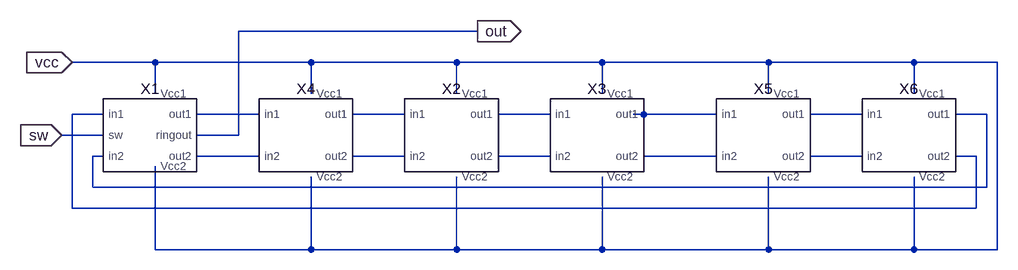
[diagram p0: schematic ring24.asc]
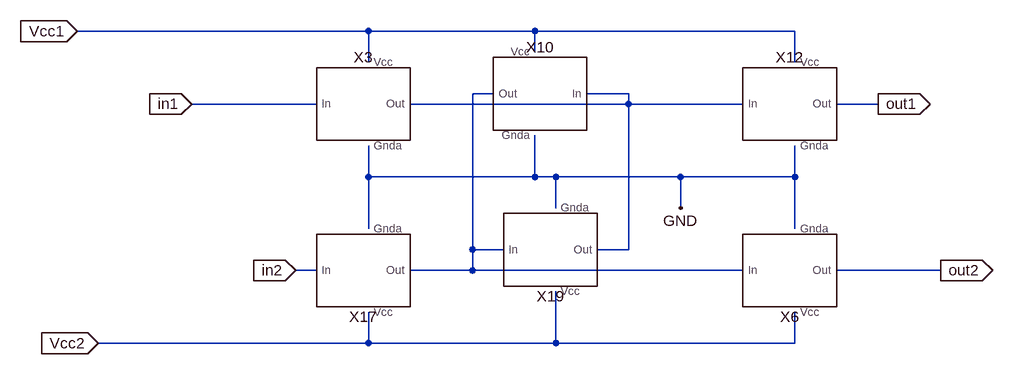
[diagram p1: sub-circuit unit.asc]
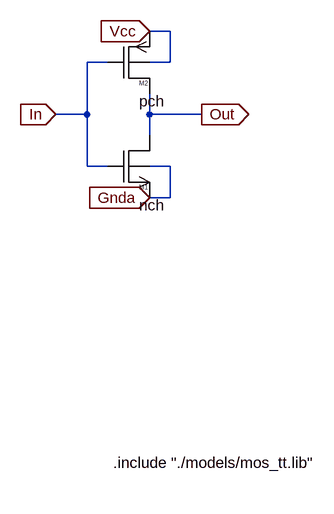
[diagram p2: sub-circuit inverter.asc]
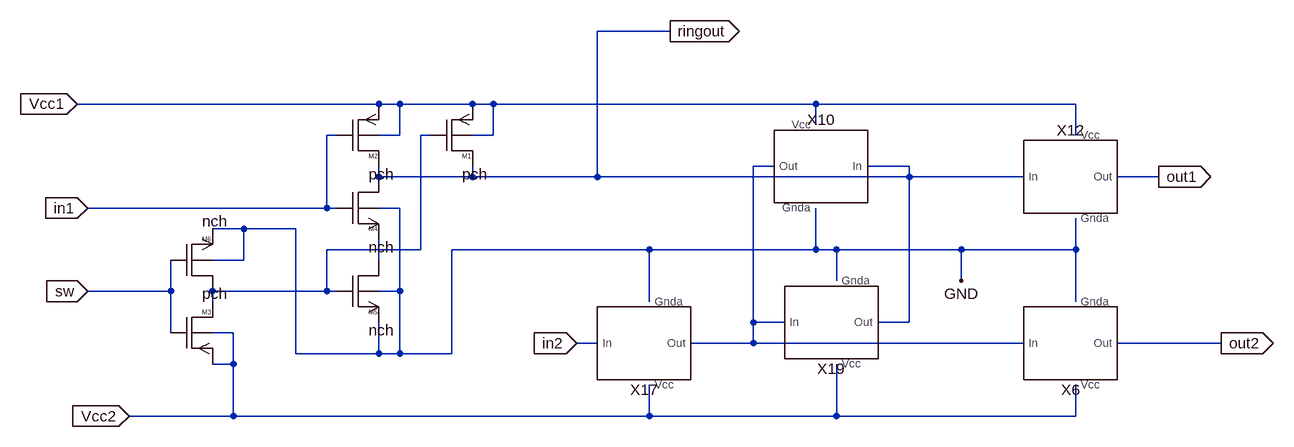
[diagram p3: sub-circuit unit_nand.asc]
ring24.asc, the LTspice schematic file:
Version 4
SHEET 1 948 680
WIRE 128 -32 -240 -32
WIRE -368 16 -496 16
WIRE -128 16 -368 16
WIRE 96 16 -128 16
WIRE 320 16 96 16
WIRE 576 16 320 16
WIRE 800 16 576 16
WIRE 928 16 800 16
WIRE -368 64 -368 16
WIRE -128 64 -128 16
WIRE 96 64 96 16
WIRE 320 64 320 16
WIRE 576 64 576 16
WIRE 800 64 800 16
WIRE -448 96 -496 96
WIRE -208 96 -304 96
WIRE 16 96 -64 96
WIRE 240 96 160 96
WIRE 384 96 368 96
WIRE 496 96 384 96
WIRE 720 96 640 96
WIRE 912 96 864 96
WIRE -448 128 -512 128
WIRE -240 128 -240 -32
WIRE -240 128 -304 128
WIRE -448 160 -464 160
WIRE -208 160 -304 160
WIRE 16 160 -64 160
WIRE 240 160 160 160
WIRE 496 160 384 160
WIRE 720 160 640 160
WIRE 896 160 864 160
WIRE -464 208 -464 160
WIRE 912 208 912 96
WIRE 912 208 -464 208
WIRE -496 240 -496 96
WIRE 896 240 896 160
WIRE 896 240 -496 240
WIRE -368 304 -368 176
WIRE -128 304 -128 192
WIRE -128 304 -368 304
WIRE 96 304 96 192
WIRE 96 304 -128 304
WIRE 320 304 320 192
WIRE 320 304 96 304
WIRE 576 304 576 192
WIRE 576 304 320 304
WIRE 800 304 800 192
WIRE 800 304 576 304
WIRE 928 304 928 16
WIRE 928 304 800 304
FLAG 128 -32 out
IOPIN 128 -32 Out
FLAG -496 16 vcc
IOPIN -496 16 In
FLAG -512 128 sw
IOPIN -512 128 In
SYMBOL UNIT -144 128 R0
SYMATTR InstName X4
SYMBOL UNIT_nand -384 128 R0
SYMATTR InstName X1
SYMBOL UNIT 80 128 R0
SYMATTR InstName X2
SYMBOL UNIT 304 128 R0
SYMATTR InstName X3
SYMBOL UNIT 560 128 R0
SYMATTR InstName X5
SYMBOL UNIT 784 128 R0
SYMATTR InstName X6

unit.asc, the sub-circuit schematic file:
Version 4
SHEET 1 2512 992
WIRE -1520 -880 -1968 -880
WIRE -1264 -880 -1520 -880
WIRE -864 -880 -1264 -880
WIRE -1264 -848 -1264 -880
WIRE -1520 -832 -1520 -880
WIRE -864 -832 -864 -880
WIRE -1328 -784 -1360 -784
WIRE -1120 -784 -1184 -784
WIRE -1600 -768 -1792 -768
WIRE -1120 -768 -1120 -784
WIRE -1120 -768 -1456 -768
WIRE -944 -768 -1120 -768
WIRE -736 -768 -800 -768
WIRE -1520 -656 -1520 -704
WIRE -1264 -656 -1264 -720
WIRE -1264 -656 -1520 -656
WIRE -1232 -656 -1264 -656
WIRE -1040 -656 -1232 -656
WIRE -864 -656 -864 -704
WIRE -864 -656 -1040 -656
WIRE -1232 -608 -1232 -656
WIRE -1040 -608 -1040 -656
WIRE -1520 -576 -1520 -656
WIRE -864 -576 -864 -656
WIRE -1360 -544 -1360 -784
WIRE -1312 -544 -1360 -544
WIRE -1120 -544 -1120 -768
WIRE -1120 -544 -1168 -544
WIRE -1600 -512 -1632 -512
WIRE -1360 -512 -1360 -544
WIRE -1360 -512 -1456 -512
WIRE -944 -512 -1360 -512
WIRE -640 -512 -800 -512
WIRE -1520 -400 -1520 -448
WIRE -1520 -400 -1936 -400
WIRE -1232 -400 -1232 -480
WIRE -1232 -400 -1520 -400
WIRE -864 -400 -864 -448
WIRE -864 -400 -1232 -400
FLAG -1968 -880 Vcc1
IOPIN -1968 -880 In
FLAG -1792 -768 in1
IOPIN -1792 -768 In
FLAG -736 -768 out1
IOPIN -736 -768 Out
FLAG -1632 -512 in2
IOPIN -1632 -512 In
FLAG -640 -512 out2
IOPIN -640 -512 Out
FLAG -1040 -608 GND
FLAG -1936 -400 Vcc2
IOPIN -1936 -400 In
SYMBOL inverter -1536 -768 R0
SYMATTR InstName X3
SYMBOL inverter -880 -512 M180
SYMATTR InstName X6
SYMBOL inverter -880 -768 R0
SYMATTR InstName X12
SYMBOL inverter -1536 -512 M180
SYMATTR InstName X17
SYMBOL inverter -1248 -784 M0
SYMATTR InstName X10
SYMBOL inverter -1248 -544 M180
SYMATTR InstName X19

inverter.asc, the sub-circuit schematic file:
Version 4
SHEET 1 880 696
WIRE 192 16 160 16
WIRE 96 64 64 64
WIRE 192 64 192 16
WIRE 192 64 160 64
WIRE 64 144 64 64
WIRE 64 144 16 144
WIRE 160 144 160 112
WIRE 240 144 160 144
WIRE 160 176 160 144
WIRE 64 224 64 144
WIRE 96 224 64 224
WIRE 192 224 160 224
WIRE 192 272 192 224
WIRE 192 272 160 272
FLAG 16 144 In
IOPIN 16 144 In
FLAG 240 144 Out
IOPIN 240 144 Out
FLAG 160 16 Vcc
IOPIN 160 16 In
FLAG 160 272 Gnda
IOPIN 160 272 In
SYMBOL nmos4 96 224 R0
WINDOW 3 48 60 Left 2
SYMATTR InstName M1
SYMATTR Value nch
SYMATTR Value2 l=2u w=6u
SYMBOL pmos4 96 64 R0
WINDOW 3 48 60 Left 2
SYMATTR InstName M2
SYMATTR Value pch
SYMATTR Value2 l=2u w=18u
TEXT 104 680 Left 2 !.include "./models/mos_tt.lib"\n

unit_nand.asc, the sub-circuit schematic file:
Version 4
SHEET 1 2512 992
WIRE -1488 -992 -1600 -992
WIRE -1936 -880 -2400 -880
WIRE -1904 -880 -1936 -880
WIRE -1792 -880 -1904 -880
WIRE -1760 -880 -1792 -880
WIRE -1264 -880 -1760 -880
WIRE -864 -880 -1264 -880
WIRE -1264 -848 -1264 -880
WIRE -2000 -832 -2016 -832
WIRE -1904 -832 -1904 -880
WIRE -1904 -832 -1936 -832
WIRE -1856 -832 -1872 -832
WIRE -1760 -832 -1760 -880
WIRE -1760 -832 -1792 -832
WIRE -864 -832 -864 -880
WIRE -1328 -784 -1360 -784
WIRE -1120 -784 -1184 -784
WIRE -1936 -768 -1936 -784
WIRE -1792 -768 -1792 -784
WIRE -1792 -768 -1936 -768
WIRE -1600 -768 -1600 -992
WIRE -1600 -768 -1792 -768
WIRE -1120 -768 -1120 -784
WIRE -1120 -768 -1600 -768
WIRE -944 -768 -1120 -768
WIRE -736 -768 -800 -768
WIRE -2016 -720 -2016 -832
WIRE -2016 -720 -2384 -720
WIRE -2000 -720 -2016 -720
WIRE -1904 -720 -1936 -720
WIRE -2144 -688 -2192 -688
WIRE -2064 -688 -2144 -688
WIRE -1872 -656 -1872 -832
WIRE -1872 -656 -2016 -656
WIRE -1520 -656 -1824 -656
WIRE -1264 -656 -1264 -720
WIRE -1264 -656 -1520 -656
WIRE -1232 -656 -1264 -656
WIRE -1040 -656 -1232 -656
WIRE -864 -656 -864 -704
WIRE -864 -656 -1040 -656
WIRE -2144 -640 -2144 -688
WIRE -2144 -640 -2192 -640
WIRE -1936 -640 -1936 -672
WIRE -1232 -608 -1232 -656
WIRE -1040 -608 -1040 -656
WIRE -2256 -592 -2256 -640
WIRE -2256 -592 -2384 -592
WIRE -2016 -592 -2016 -656
WIRE -2016 -592 -2192 -592
WIRE -2000 -592 -2016 -592
WIRE -1904 -592 -1904 -720
WIRE -1904 -592 -1936 -592
WIRE -2192 -576 -2192 -592
WIRE -1520 -576 -1520 -656
WIRE -864 -576 -864 -656
WIRE -1360 -544 -1360 -784
WIRE -1312 -544 -1360 -544
WIRE -1120 -544 -1120 -768
WIRE -1120 -544 -1168 -544
WIRE -2256 -528 -2256 -592
WIRE -2160 -528 -2192 -528
WIRE -1600 -512 -1632 -512
WIRE -1360 -512 -1360 -544
WIRE -1360 -512 -1456 -512
WIRE -944 -512 -1360 -512
WIRE -640 -512 -800 -512
WIRE -2064 -496 -2064 -688
WIRE -1936 -496 -1936 -544
WIRE -1936 -496 -2064 -496
WIRE -1904 -496 -1904 -592
WIRE -1904 -496 -1936 -496
WIRE -1824 -496 -1824 -656
WIRE -1824 -496 -1904 -496
WIRE -2160 -480 -2160 -528
WIRE -2160 -480 -2192 -480
WIRE -2160 -400 -2160 -480
WIRE -2160 -400 -2320 -400
WIRE -1520 -400 -1520 -448
WIRE -1520 -400 -2160 -400
WIRE -1232 -400 -1232 -480
WIRE -1232 -400 -1520 -400
WIRE -864 -400 -864 -448
WIRE -864 -400 -1232 -400
FLAG -2400 -880 Vcc1
IOPIN -2400 -880 In
FLAG -2384 -720 in1
IOPIN -2384 -720 In
FLAG -736 -768 out1
IOPIN -736 -768 Out
FLAG -1632 -512 in2
IOPIN -1632 -512 In
FLAG -640 -512 out2
IOPIN -640 -512 Out
FLAG -1040 -608 GND
FLAG -2384 -592 sw
IOPIN -2384 -592 In
FLAG -1488 -992 ringout
IOPIN -1488 -992 Out
FLAG -2320 -400 Vcc2
IOPIN -2320 -400 In
SYMBOL inverter -880 -512 M180
SYMATTR InstName X6
SYMBOL inverter -880 -768 R0
SYMATTR InstName X12
SYMBOL inverter -1536 -512 M180
SYMATTR InstName X17
SYMBOL inverter -1248 -784 M0
SYMATTR InstName X10
SYMBOL inverter -1248 -544 M180
SYMATTR InstName X19
SYMBOL pmos4 -1856 -832 R0
WINDOW 3 48 60 Left 2
SYMATTR InstName M1
SYMATTR Value pch
SYMATTR Value2 l=2u w=18u
SYMBOL pmos4 -2000 -832 R0
WINDOW 3 48 60 Left 2
SYMATTR InstName M2
SYMATTR Value pch
SYMATTR Value2 l=2u w=18u
SYMBOL nmos4 -2000 -720 R0
WINDOW 3 48 60 Left 2
SYMATTR InstName M4
SYMATTR Value nch
SYMATTR Value2 l=2u w=6u
SYMBOL nmos4 -2000 -592 R0
WINDOW 3 48 60 Left 2
SYMATTR InstName M5
SYMATTR Value nch
SYMATTR Value2 l=2u w=6u
SYMBOL pmos4 -2256 -528 M180
WINDOW 3 48 60 Left 2
SYMATTR InstName M3
SYMATTR Value pch
SYMATTR Value2 l=2u w=18u
SYMBOL nmos4 -2256 -640 M180
WINDOW 3 48 60 Left 2
SYMATTR InstName M6
SYMATTR Value nch
SYMATTR Value2 l=2u w=6u

The netlist it stands for:
* ring24.asc
XX4 N002 N008 vcc N003 N009 vcc unit
XX1 N001 N007 vcc N002 N008 sw out vcc unit_nand
XX2 N003 N009 vcc N004 N010 vcc unit
XX3 N004 N010 vcc N005 N011 vcc unit
XX5 N005 N011 vcc N006 N012 vcc unit
XX6 N006 N012 vcc N007 N001 vcc unit

* block symbol definitions
.subckt unit in1 in2 Vcc1 out1 out2 Vcc2
XX3 GND in1 Vcc1 N002 inverter
XX6 GND N001 Vcc2 out2 inverter
XX12 GND N002 Vcc1 out1 inverter
XX17 GND in2 Vcc2 N001 inverter
XX10 GND N002 Vcc1 N001 inverter
XX19 GND N001 Vcc2 N002 inverter
.ends unit

.subckt inverter Gnda In Vcc Out
M1 Out In Gnda Gnda nch l=2u w=6u
M2 Out In Vcc Vcc pch l=2u w=18u
.include "./models/mos_tt.lib"
.ends inverter

.subckt unit_nand in1 in2 Vcc1 out1 out2 sw ringout Vcc2
XX6 GND N002 Vcc2 out2 inverter
XX12 GND ringout Vcc1 out1 inverter
XX17 GND in2 Vcc2 N002 inverter
XX10 GND ringout Vcc1 N002 inverter
XX19 GND N002 Vcc2 ringout inverter
M1 ringout N001 Vcc1 Vcc1 pch l=2u w=18u
M2 ringout in1 Vcc1 Vcc1 pch l=2u w=18u
M4 ringout in1 N003 GND nch l=2u w=6u
M5 N003 N001 GND GND nch l=2u w=6u
M3 N001 sw Vcc2 Vcc2 pch l=2u w=18u
M6 N001 sw GND GND nch l=2u w=6u
.ends unit_nand

.model NMOS NMOS
.model PMOS PMOS
.lib standard.mos
.backanno
.end